# Altium schematic sheet PushButton.SchDoc
size A4
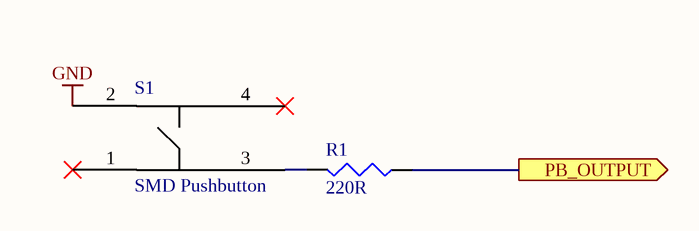
[diagram p0: PushButton.SchDoc]

## Parts
R1  value 220R  [6-0805_N]  (hidden comment: 0805)
S1  SMD Pushbutton  [SMD_PB]

## Ports
PB_OUTPUT (out)

## Nets
GND: S1.2
PB_OUTPUT: R1.1 ; port PB_OUTPUT
NetR1_2: R1.2 S1.3

Not connected (* = marked no-connect by the designer): S1 1* 4*

## Library data of the parts
R1 = Res3: Resistor, 0.25W
S1 = SMD_PB